# Altium schematic sheet sheet2_radio.SchDoc: nRF52832 MCU
size A3; Organization: Nordic Semiconductor; DocumentNumber: 2; SheetNumber: 2; SheetTotal: 6; CompanyName: Nordic Semiconductor; DocumentSize: A3
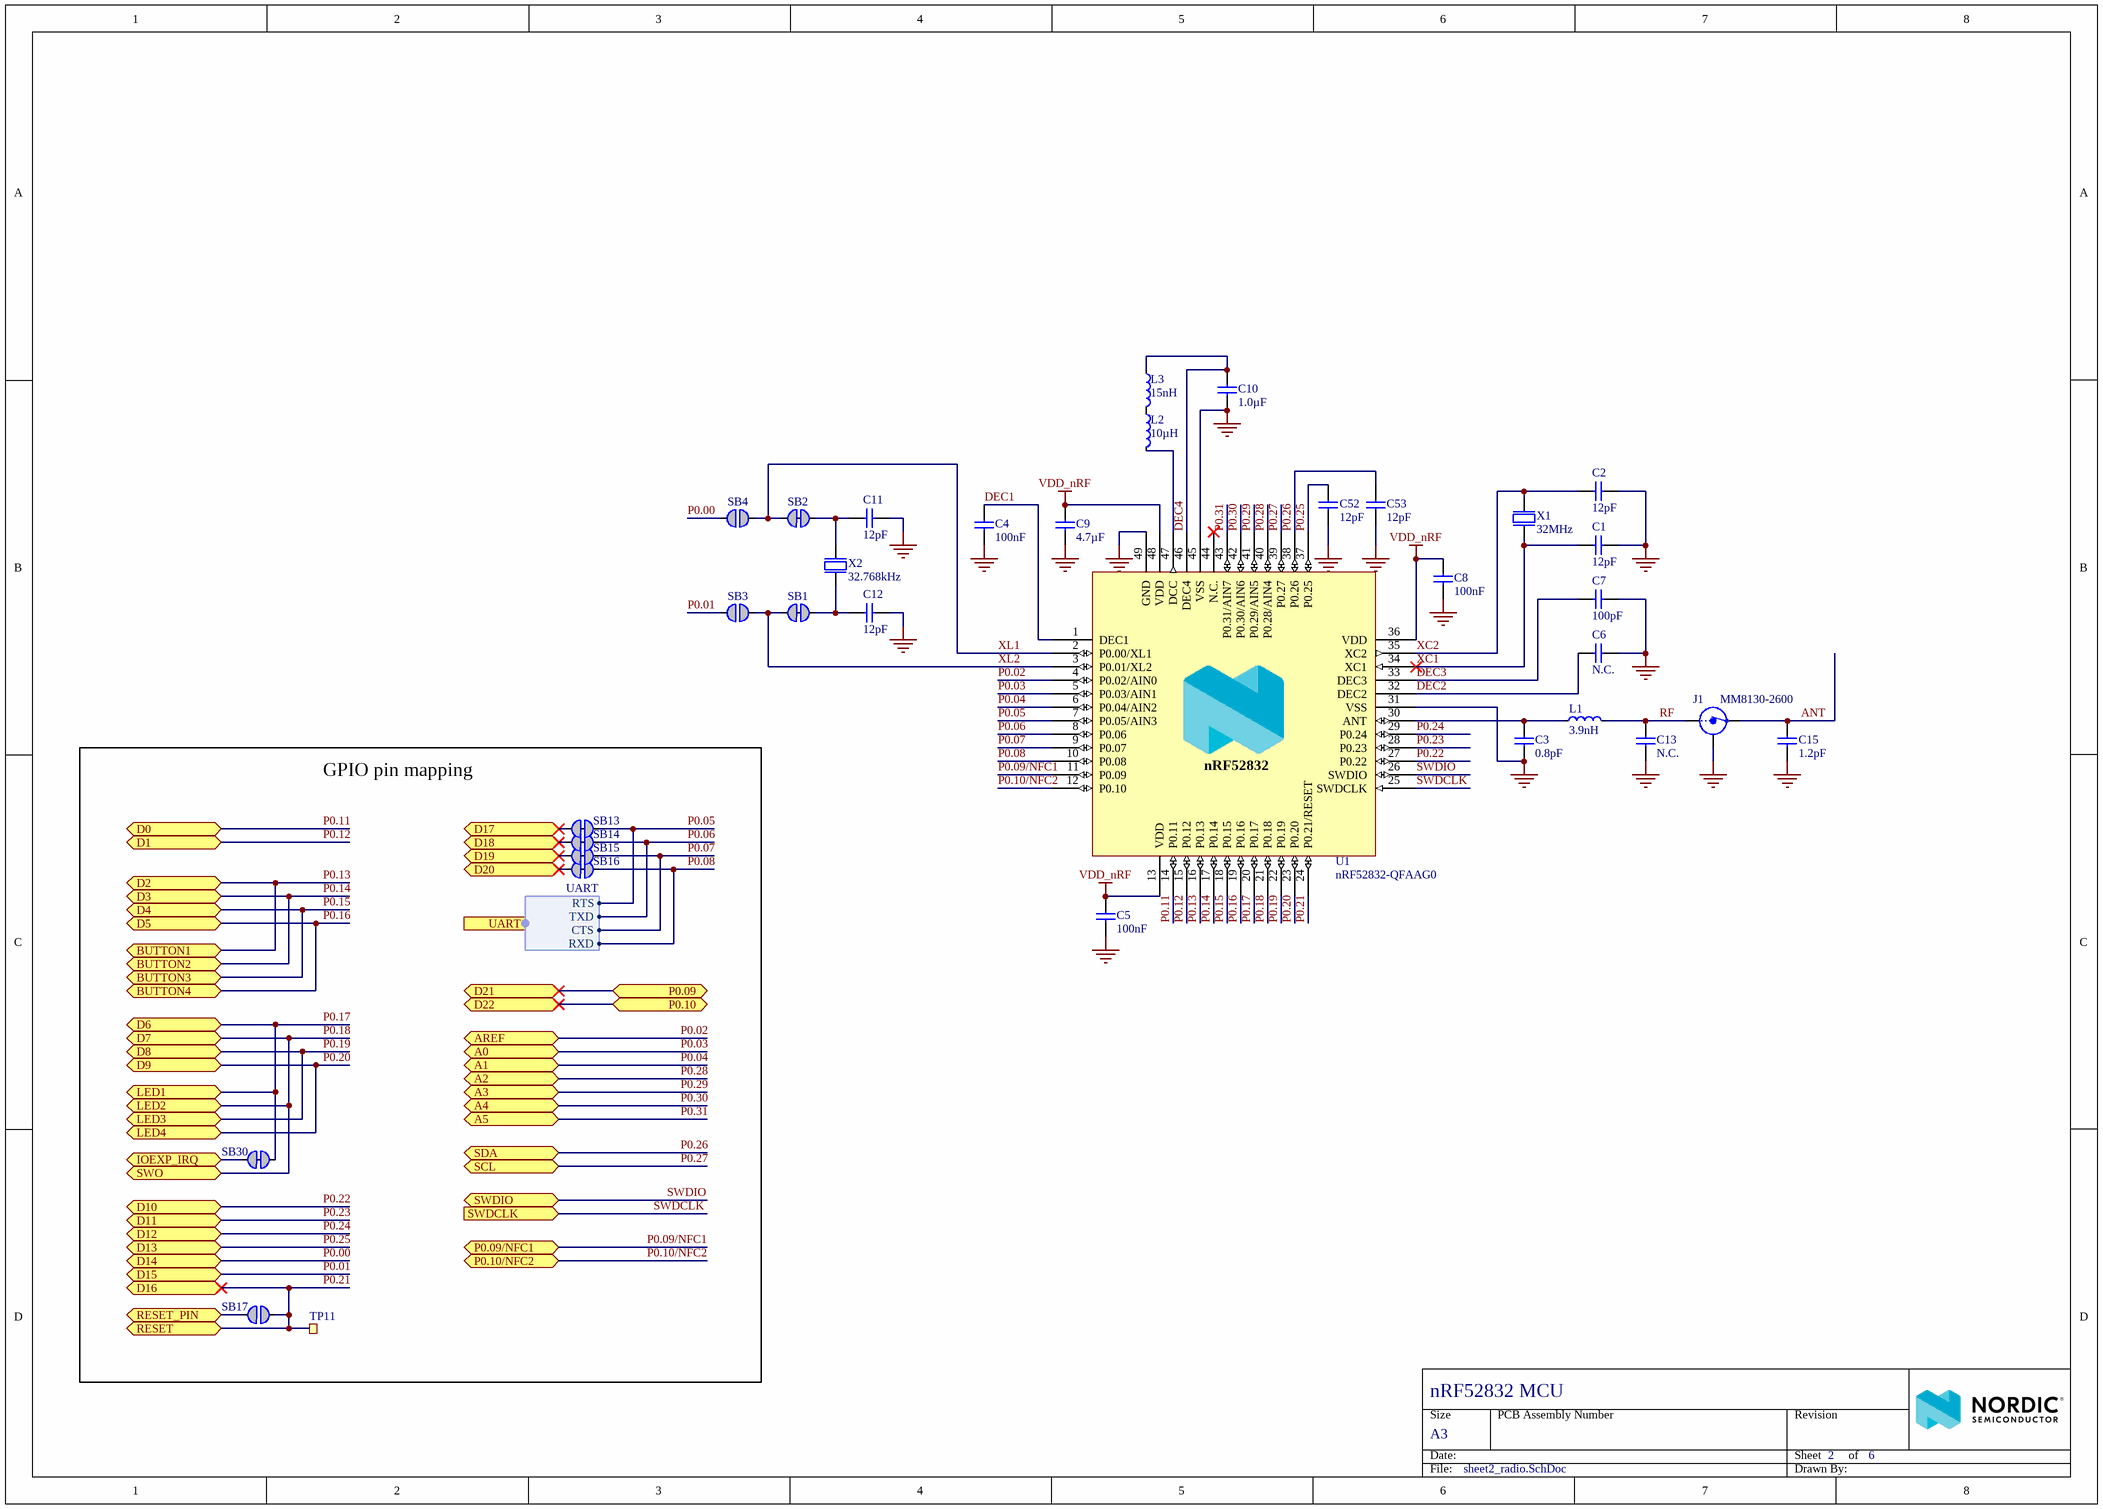
[diagram p0: sheet2_radio.SchDoc]

## Parts
C1  12pF  [CAPC1005X04L]
C2  12pF  [CAPC1005X04L]
C3  0.8pF  [CAPC1005X04L]
C4  100nF  [CAPC1005X04L]
C5  100nF  [CAPC1005X04L]
C6  N.C.  [CAPC1005X04L_NC]
C7  100pF  [CAPC1005X04L]
C8  100nF  [CAPC1005X04L]
C9  4.7µF  [CAPC1608X06L]
C10  1.0µF  [CAPC1608X06L]
C11  12pF  [CAPC1005X04L]
C12  12pF  [CAPC1005X04L]
C13  N.C.  [CAPC1005X04L_NC]
C15  1.2pF  [CAPC1005X04L]
C52  12pF  [CAPC1005X04L]
C53  12pF  [CAPC1005X04L]
J1  MM8130-2600  [COAXIAL-SWF]
L1  3.9nH  [INDC1005X04L]
L2  10µH  [INDC1608X06L]
L3  15nH  [INDC1005X04L]
SB1  Solderbridge  [Solderbridge_Shorted]  (value not drawn)  (net tie, no BOM)
SB2  Solderbridge  [Solderbridge_Shorted]  (value not drawn)  (net tie, no BOM)
SB3  Solderbridge  [Solderbridge]  (value not drawn)  (no BOM)
SB4  Solderbridge  [Solderbridge]  (value not drawn)  (no BOM)
SB13  Solderbridge  [Solderbridge_Shorted]  (value not drawn)  (net tie, no BOM)
SB14  Solderbridge  [Solderbridge_Shorted]  (value not drawn)  (net tie, no BOM)
SB15  Solderbridge  [Solderbridge_Shorted]  (value not drawn)  (net tie, no BOM)
SB16  Solderbridge  [Solderbridge_Shorted]  (value not drawn)  (net tie, no BOM)
SB17  Solderbridge  [Solderbridge]  (value not drawn)  (no BOM)
SB30  Solderbridge  [Solderbridge_Shorted]  (value not drawn)  (net tie, no BOM)
TP11  Ø1.0mm,SMD  [TP_SMD_D1.0mm]  (value not drawn)  (no BOM)
U1  nRF52832-QFAAG0  [QFN40P600X600X90-48N]
X1  32MHz  [BT-XTAL_2016]
X2  32.768kHz  [XTAL_3215]

## Blocks framed on the sheet
GPIO pin mapping: SB13-SB17 SB30 TP11

## Ports
A0 (bidir), A1 (bidir), A2 (bidir), A3 (bidir), A4 (bidir), A5 (bidir), AREF (bidir), BUTTON1 (bidir), BUTTON2 (bidir), BUTTON3 (bidir), BUTTON4 (bidir), D0 (bidir), D1 (bidir), D2 (bidir), D3 (bidir), D4 (bidir), D5 (bidir), D6 (bidir), D7 (bidir), D8 (bidir), D9 (bidir), D10 (bidir), D11 (bidir), D12 (bidir), D13 (bidir), D14 (bidir), D15 (bidir), D16 (bidir), D17 (bidir), D18 (bidir), D19 (bidir), D20 (bidir), D21 (bidir), D22 (bidir), IOEXP_IRQ (bidir), LED1 (bidir), LED2 (bidir), LED3 (bidir), LED4 (bidir), P0.09 (bidir), P0.09/NFC1 (bidir), P0.10 (bidir), P0.10/NFC2 (bidir), RESET (bidir), RESET_PIN (bidir), SCL (bidir), SDA (bidir), SWDCLK (in), SWDIO (bidir), SWO (bidir), UART (harness UART)

## Harnesses
UART: RTS, TXD, CTS, RXD

## Nets
GND: C1.2 C2.2 C3.1 C4.2 C5.2 C6.2 C7.2 C8.2 C9.2 C10.1 C11.1 C12.1 C13.2 C15.2 C52.2 C53.2 J1.2(Shield) U1.31(VSS) U1.45(VSS) U1.49(GND) X1.2(GND) X1.4(GND)
VDD_nRF: C5.1 C8.1 C9.1 U1.13(VDD) U1.36(VDD) U1.48(VDD)
ANT: C15.1 J1.3(OUT)
D17: SB13.1 ; port D17
D18: SB14.1 ; port D18
D19: SB15.1 ; port D19
D20: SB16.1 ; port D20
D21: port D21, port P0.09
D22: port D22, port P0.10
DEC1: C4.1 U1.1(DEC1)
DEC2: C6.1 U1.32(DEC2)
DEC3: C7.1 U1.33(DEC3)
DEC4: C10.2 L3.1 U1.46(DEC4)
IOEXP_IRQ: SB30.2 ; port IOEXP_IRQ
P0.00: SB4.2 ; port D14
P0.01: SB3.2 ; port D15
P0.02: U1.4(P0.02/AIN0) ; port AREF
P0.03: U1.5(P0.03/AIN1) ; port A0
P0.04: U1.6(P0.04/AIN2) ; port A1
P0.05: SB13.2 U1.7(P0.05/AIN3) ; port UART.RTS
P0.06: SB14.2 U1.8(P0.06) ; port UART.TXD
P0.07: SB15.2 U1.9(P0.07) ; port UART.CTS
P0.08: SB16.2 U1.10(P0.08) ; port UART.RXD
P0.09/NFC1: U1.11(P0.09) ; port P0.09/NFC1
P0.10/NFC2: U1.12(P0.10) ; port P0.10/NFC2
P0.11: U1.14(P0.11) ; port D0
P0.12: U1.15(P0.12) ; port D1
P0.13: U1.16(P0.13) ; port D2, port BUTTON1
P0.14: U1.17(P0.14) ; port D3, port BUTTON2
P0.15: U1.18(P0.15) ; port D4, port BUTTON3
P0.16: U1.19(P0.16) ; port D5, port BUTTON4
P0.17: SB30.1 U1.20(P0.17) ; port D6, port LED1
P0.18: U1.21(P0.18) ; port D7, port LED2, port SWO
P0.19: U1.22(P0.19) ; port D8, port LED3
P0.20: U1.23(P0.20) ; port D9, port LED4
P0.21: SB17.2 TP11.1 U1.24(P0.21/RESET) ; port RESET, port D16
P0.22: U1.27(P0.22) ; port D10
P0.23: U1.28(P0.23) ; port D11
P0.24: U1.29(P0.24) ; port D12
P0.25: C52.1 U1.37(P0.25) ; port D13
P0.26: C53.1 U1.38(P0.26) ; port SDA
P0.27: U1.39(P0.27) ; port SCL
P0.28: U1.40(P0.28/AIN4) ; port A2
P0.29: U1.41(P0.29/AIN5) ; port A3
P0.30: U1.42(P0.30/AIN6) ; port A4
P0.31: U1.43(P0.31/AIN7) ; port A5
RESET_PIN: SB17.1 ; port RESET_PIN
RF: C13.1 J1.1(IN) L1.2
SWDCLK: U1.25(SWDCLK) ; port SWDCLK
SWDIO: U1.26(SWDIO) ; port SWDIO
XC1: C1.1 U1.34(XC1) X1.1(inp)
XC2: C2.1 U1.35(XC2) X1.3(out)
XL1: SB2.2 SB4.1 U1.2(P0.00/XL1)
XL2: SB1.2 SB3.1 U1.3(P0.01/XL2)
NetC3_2: C3.2 L1.1 U1.30(ANT)
NetC11_2: C11.2 SB2.1 X2.1(inp)
NetC12_2: C12.2 SB1.1 X2.2(out)
NetL2_1: L2.1 L3.2
NetL2_2: L2.2 U1.47(DCC)

Not connected (* = marked no-connect by the designer): U1 44(N.C.)*

## Notes on the sheet
- Size
- Date:
- A3
- PCB Assembly Number
- Sheet         of
- Revision
- File:
- Drawn By:
- (in symbol nRF52832-QFAAG0) nRF52832

## Library data of the parts
C1 C2 C11 C12 C52 C53 = C0402-12p: Capacitor, NP0, ±2%; Manufacturer: N.A.; Part number IPS: 00000002398; Note: 50V; Artikkelnr Noca: 20029159; Pad Count: 2; Part Number: C0402-12p; Manufacturer Part Number: N.A.; LatestRevisionDate: 2011-05-11; Published: 2009-05-08; Value: 12pF; Footprint Doc: 0402; ComponentLink1URL: N.A.; ComponentLink1Description: Datasheet; ComponentLink2URL: N.A.; ComponentLink2Description: Supplier link; HelpURL: N.A.; Supplier 1: N.A.; Supplier Part Number 1: N.A.; Supplier 2: N.A.; Supplier Part Number 2: N.A.; PartId: 100200137; Component Class: Capacitors; Author: rsk; Part number Norautron: N.A.
C3 = C0402-0.8p: Capacitor, NP0, ±5%; Manufacturer: Murata; Manufacturer Part Number: GRM1555C1HR80WA01D; Part number IPS: 00000007782; Part number Norautron: N.A.; Note: 50V; Artikkelnr Noca: 20029147; Pad Count: 2; Part Number: C0402-0.8p; LatestRevisionDate: 2012-11-21; Published: 2009-05-08; Value: 0.8pF; Footprint Doc: 0402; ComponentLink1URL: https://www.murata.com/~/media/webrenewal/support/library/catalog/products/capacitor/mlcc/c02e.ashx?la=en-us; ComponentLink1Description: Datasheet; ComponentLink2URL: N.A.; ComponentLink2Description: Supplier link; HelpURL: N.A.; Supplier 1: Digi-Key; Supplier Part Number 1: 490-6270-1-ND; Supplier 2: N.A.; Supplier Part Number 2: N.A.; PartId: 100200116; Component Class: Capacitors; Author: rsk
C4 C5 C8 = C0402-100n: Capacitor, X7R, ±10%; Manufacturer: N.A.; Part number IPS: 00000005296; Note: 16V; Artikkelnr Noca: 20039200; Pad Count: 2; Part Number: C0402-100n; Manufacturer Part Number: N.A.; LatestRevisionDate: 2009-11-23; Published: 2009-05-08; Value: 100nF; Footprint Doc: 0402; ComponentLink1URL: N.A.; ComponentLink1Description: Datasheet; ComponentLink2URL: N.A.; ComponentLink2Description: Supplier link; HelpURL: N.A.; Supplier 1: N.A.; Supplier Part Number 1: N.A.; Supplier 2: N.A.; Supplier Part Number 2: N.A.; PartId: 100200184; Component Class: Capacitors; Author: rsk; Part number Norautron: N.A.
C6 C13 = C0402-N.C.: Not mounted; Manufacturer: N.A.; Note: Chip Cap; Assembly: Not mounted; Pad Count: 2; Part Number: C0402-N.C.; Manufacturer Part Number: N.A.; Footprint Doc: 0402; LatestRevisionDate: 2009-05-08; Published: 2009-05-08; Value: N.C.; Artikkelnr Noca: N.A.; Part number IPS: N.A.; ComponentLink1URL: N.A.; ComponentLink1Description: Datasheet; ComponentLink2URL: N.A.; ComponentLink2Description: Supplier link; HelpURL: N.A.; Supplier 1: N.A.; Supplier Part Number 1: N.A.; Supplier 2: N.A.; Supplier Part Number 2: N.A.; PartId: 100200105; Component Class: Capacitors; Author: rsk; Part number Norautron: N.A.
C7 = C0402-100p: Capacitor, NP0, ±5%; Manufacturer: N.A.; Part number IPS: 00000002361; Note: 50V; Artikkelnr Noca: 20029135; Pad Count: 2; Part Number: C0402-100p; Manufacturer Part Number: N.A.; LatestRevisionDate: 2009-05-08; Published: 2009-05-08; Value: 100pF; Footprint Doc: 0402; ComponentLink1URL: N.A.; ComponentLink1Description: Datasheet; ComponentLink2URL: N.A.; ComponentLink2Description: Supplier link; HelpURL: N.A.; Supplier 1: N.A.; Supplier Part Number 1: N.A.; Supplier 2: N.A.; Supplier Part Number 2: N.A.; PartId: 100200148; Component Class: Capacitors; Author: rsk; Part number Norautron: N.A.
C9 = C0603-4µ7: Capacitor, X5R, ±10%; Manufacturer: N.A.; Part number IPS: 00000007783; Note: 6.3V; Artikkelnr Noca: 20069060; Pad Count: 2; Part Number: C0603-4µ7; Manufacturer Part Number: N.A.; LatestRevisionDate: 2009-11-23; Published: 2009-05-08; Value: 4.7µF; Footprint Doc: 0603; ComponentLink1URL: N.A.; ComponentLink1Description: Datasheet; ComponentLink2URL: N.A.; ComponentLink2Description: Supplier link; HelpURL: N.A.; Supplier 1: N.A.; Supplier Part Number 1: N.A.; Supplier 2: N.A.; Supplier Part Number 2: N.A.; PartId: 100200274; Component Class: Capacitors; Author: rsk; Part number Norautron: N.A.
C10 = C0603-1µ0: Capacitor, X7R, ±10%; Manufacturer: N.A.; Part number IPS: 00000000616; Note: 16V; Artikkelnr Noca: 20039282; Pad Count: 2; Part Number: C0603-1µ0; Manufacturer Part Number: N.A.; LatestRevisionDate: 2013-06-05; Published: 2009-05-08; Value: 1.0µF; Footprint Doc: 0603; ComponentLink1URL: N.A.; ComponentLink1Description: Datasheet; ComponentLink2URL: N.A.; ComponentLink2Description: Supplier link; HelpURL: N.A.; Supplier 1: N.A.; Supplier Part Number 1: N.A.; Supplier 2: N.A.; Supplier Part Number 2: N.A.; PartId: 100200271; Component Class: Capacitors; Author: rsk; Part number Norautron: N.A.
C15 = C0402-1.2p: Capacitor, NP0, ±0.1pF; Manufacturer: N.A.; Part number IPS: 00000005410; Note: 50V; Artikkelnr Noca: 20029157; Pad Count: 2; Part Number: C0402-1.2p; Manufacturer Part Number: N.A.; LatestRevisionDate: 2011-05-11; Published: 2009-05-08; Value: 1.2pF; Footprint Doc: 0402; ComponentLink1URL: N.A.; ComponentLink1Description: Datasheet; ComponentLink2URL: N.A.; ComponentLink2Description: Supplier link; HelpURL: N.A.; Supplier 1: N.A.; Supplier Part Number 1: N.A.; Supplier 2: N.A.; Supplier Part Number 2: N.A.; PartId: 100200119; Component Class: Capacitors; Author: rsk; Part number Norautron: N.A.
J1 = MM8130-2600: Coaxial Connector with Switch; Manufacturer: Murata; Part number IPS: 00000009955; Note: N.A.; Artikkelnr Noca: 55029011; Pad Count: 3; Part Number: MM8130-2600; Manufacturer Part Number: MM8130-2600; LatestRevisionDate: 2014-04-24; Published: 2014-04-24; Value: MM8130-2600; Footprint Doc: COAXIAL-SWF; ComponentLink1URL: N.A.; ComponentLink1Description: Datasheet; ComponentLink2URL: N.A.; ComponentLink2Description: Supplier link; HelpURL: http://www.murata.com/products/catalog/pdf/o33e.pdf; Supplier 1: Digi-Key; Supplier Part Number 1: 490-4981-1-ND; Supplier 2: Mouser; Supplier Part Number 2: 81-MM8130-2600RA2; PartId: 100500400; Component Class: Connectors; Author: rsk; Part number Norautron: N.A.
L1 = L0402-3n9: Inductor, 170mA, ±0.1nH; Manufacturer: Murata; Manufacturer Part Number: LQP15MN3N9B02D; Part number IPS: 00000007793; Part number Norautron: N.A.; Note: High frequency chip inductor ±5%; Artikkelnr Noca: 33029151; Pad Count: 2; Part Number: L0402-3n9; LatestRevisionDate: 2012-09-19; Published: 2009-05-08; Value: 3.9nH; Footprint Doc: 0402; ComponentLink1Description: Datasheet; ComponentLink2Description: Supplier link; ComponentLink1URL: N.A.; ComponentLink2URL: N.A.; HelpURL: http://search.murata.co.jp/Ceramy/image/img/PDF/ENG/L0075S0084LQP15M.pdf; Supplier 1: Digi-Key; Supplier Part Number 1: 490-1131-1-ND; Supplier 2: N.A.; Supplier Part Number 2: N.A.; PartId: 100300049; Component Class: Inductors; Author: rsk
L2 = L0603-10µ: Inductor, 80mA, ±10%; Manufacturer: Taiyo Yuden; Manufacturer Part Number: LBMF1608T100K; Part number IPS: 00000007794; Part number Norautron: N.A.; Note: LBMF1608T100K 10µH 80mA 0603; Artikkelnr Noca: 33029314; Pad Count: 2; Part Number: L0603-10µ; LatestRevisionDate: 2012-09-19; Published: 2010-02-24; Value: 10µH; Footprint Doc: 0603; ComponentLink1Description: Datasheet; ComponentLink2Description: Supplier link; ComponentLink1URL: N.A.; ComponentLink2URL: N.A.; HelpURL: http://www.yuden.co.jp/ut/product/pdf/elb2_e.pdf; Supplier 1: Digi-Key; Supplier Part Number 1: 587-1714-1-ND; Supplier 2: Farnell; Supplier Part Number 2: 178-6105; PartId: 100300078; Component Class: Inductors; Author: rsk
L3 = L0402-15n: Inductor, 320mA, ±5%; Manufacturer: Taiyo Yuden; Manufacturer Part Number: HK100515NJ-T; Part number IPS: 00000001262; Part number Norautron: N.A.; Note: High frequency chip inductor ±10%; Artikkelnr Noca: 33029323; Pad Count: 2; Part Number: L0402-15n; LatestRevisionDate: 2012-09-19; Published: 2010-07-12; Value: 15nH; Footprint Doc: 0402; ComponentLink1Description: Datasheet; ComponentLink2Description: Supplier link; ComponentLink1URL: N.A.; ComponentLink2URL: N.A.; HelpURL: http://www.yuden.co.jp/productdata/catalog/en/mlci04_e.pdf; Supplier 1: Digi-Key; Supplier Part Number 1: 587-1521-1-ND; Supplier 2: Farnell; Supplier Part Number 2: 658-1328; PartId: 100300056; Component Class: Inductors; Author: rsk
SB1 SB2 SB13-SB16 SB30 = Solderbridge Shorted: Shorted Solderbridge; Manufacturer: N.A.; Pad Count: 2; Part Number: Solderbridge Shorted; Manufacturer Part Number: N.A.; LatestRevisionDate: 2012-08-07; Published: 2012-08-07; Value: Solderbridge; Note: N.A.; Artikkelnr Noca: N.A.; Footprint Doc: Solderbridge_Shorted; Part number IPS: N.A.; ComponentLink1URL: N.A.; ComponentLink1Description: Datasheet; ComponentLink2URL: N.A.; ComponentLink2Description: Supplier link; HelpURL: N.A.; Supplier 1: N.A.; Supplier Part Number 1: N.A.; Supplier 2: N.A.; Supplier Part Number 2: N.A.; PartId: 100500459; Component Class: Connectors; Author: rsk; Part number Norautron: N.A.
SB3 SB4 SB17 = Solderbridge: Manufacturer: N.A.; Pad Count: 2; Part Number: Solderbridge; Manufacturer Part Number: N.A.; LatestRevisionDate: 2009-12-14; Published: 2009-12-14; Value: Solderbridge; Note: N.A.; Artikkelnr Noca: N.A.; Footprint Doc: Solderbridge; Part number IPS: N.A.; ComponentLink1URL: N.A.; ComponentLink1Description: Datasheet; ComponentLink2URL: N.A.; ComponentLink2Description: Supplier link; HelpURL: N.A.; Supplier 1: N.A.; Supplier Part Number 1: N.A.; Supplier 2: N.A.; Supplier Part Number 2: N.A.; PartId: 100500458; Component Class: Connectors; Author: rsk; Part number Norautron: N.A.
TP11 = TP_SMD_Ø1.0MM: 1.0mm circular SMD testpad; Manufacturer: Nordic Semiconductor; Manufacturer Part Number: N.A.; Pad Count: 1; Part Number: TP_SMD_Ø1.0MM; LatestRevisionDate: 2021-03-05; Published: 2013-06-11; Value: Ø1.0mm,SMD; Note: N.A.; Artikkelnr Noca: N.A.; Footprint Doc: TP_SMD_Ø1.0mm; Part number IPS: N.A.; ComponentLink1URL: N.A.; ComponentLink1Description: Datasheet; ComponentLink2URL: N.A.; ComponentLink2Description: Supplier link; HelpURL: N.A.; Supplier 1: N.A.; Supplier Part Number 1: N.A.; Supplier 2: N.A.; Supplier Part Number 2: N.A.; PartId: 100500475; Component Class: Connectors; Author: rsk; Part number Norautron: N.A.
U1 = nRF52832-QFAAG0: Multi-protocol Bluetooth Low Energy, ANT and 2.4GHz proprietary system-on-chip; Manufacturer: Nordic Semiconductor; Note: N.A.; Pad Count: 48; Part Number: nRF52832-QFAAG0; Manufacturer Part Number: nRF52832-QFAAG0; LatestRevisionDate: 2021-05-31; Published: 2021-05-31; Value: nRF52832-QFAAG0; Artikkelnr Noca: N.A.; Footprint Doc: QFN-48; Part number IPS: N.A.; ComponentLink1URL: N.A.; ComponentLink1Description: Datasheet; ComponentLink2URL: N.A.; ComponentLink2Description: Supplier link; HelpURL: N.A.; Supplier 1: Nordic Semiconductor; Supplier Part Number 1: nRF52832-QFAAG0; Supplier 2: N.A.; Supplier Part Number 2: N.A.; Component Class: nRF_Devices; Author: rubr; Part number Norautron: N.A.; PartId: 102000228
X1 = XTAL_SMD2016_32MHz_8pF_Epson: XTAL SMD 2016, 32MHz, Cl=8pF, Tol: ±10ppm, Stab: ±10ppm; Manufacturer: Epson Toyocom; Manufacturer Part Number: Q22FA12800025; Part number IPS: N.A.; Note: XTAL SMD 32.000MHz; Artikkelnr Noca: 22019238; Pad Count: 4; Part Number: XTAL_SMD2016_32MHz_8pF_Epson; LatestRevisionDate: 2014-11-27; Published: 2012-03-09; Value: 32MHz; Footprint Doc: XTAL_2016; ComponentLink1URL: N.A.; ComponentLink1Description: Datasheet; ComponentLink2URL: N.A.; ComponentLink2Description: Supplier link; HelpURL: http://www.epsondevice.com/docs/qd/en/DownloadServlet?id=ID000449; Supplier 1: Farnell; Supplier Part Number 1: 171-2806; Supplier 2: N.A.; Supplier Part Number 2: N.A.; PartId: 101600036; Component Class: Oscillators; Author: rsk; Part number Norautron: N.A.
X2 = XTAL_SMD3215_32.768kHz_9pF_Epson: XTAL SMD 3215, 32.768kHz, 9pF, ±20ppm; Manufacturer: Epson Toyocom; Manufacturer Part Number: FC-135 32.768KHZ ±20PPM,9.0PF; Part number IPS: N.A.; Note: XTAL SMD 32.768kHz; Artikkelnr Noca: 22019091; Pad Count: 2; Part Number: XTAL_SMD3215_32.768kHz_9pF_Epson; LatestRevisionDate: 2017-10-18; Published: 2010-10-18; Value: 32.768kHz; Footprint Doc: XTAL_3215; ComponentLink1URL: N.A.; ComponentLink1Description: Datasheet; ComponentLink2URL: N.A.; ComponentLink2Description: Supplier link; HelpURL: http://www.farnell.com/datasheets/57480.pdf; Supplier 1: Digi-Key; Supplier Part Number 1: FC-135 32.7680KA-AC-ND; Supplier 2: Farnell; Supplier Part Number 2: 127-8037; PartId: 101600021; Component Class: Oscillators; Author: rsk; Part number Norautron: N.A.